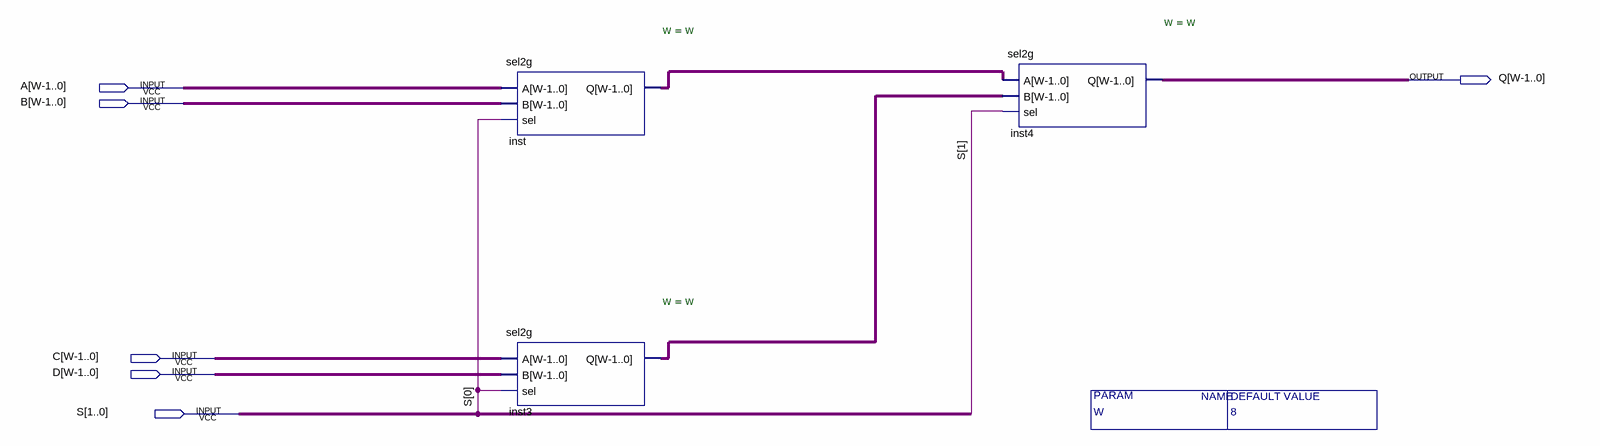
[diagram p0: schematic sheet]
// Quartus schematic sel4g.bdf as structural Verilog: 3 symbols, 6 pins
module sel4g #(parameter W = 8) (
  input  [7:0] A,
  input  [7:0] B,
  input  [7:0] C,
  input  [7:0] D,
  input  [1:0] S,
  output [7:0] Q
);

  wire [7:0] inst3_q, inst_q;

  sel2g #(.W(W)) inst (.A(A), .B(B), .sel(S[0]), .Q(inst_q));
  sel2g #(.W(W)) inst3 (.A(C), .B(D), .sel(S[0]), .Q(inst3_q));
  sel2g #(.W(W)) inst4 (.A(inst_q), .B(inst3_q), .sel(S[1]), .Q(Q));
endmodule
